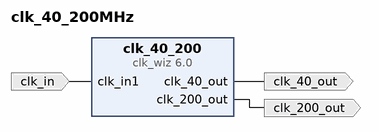
[diagram p0: block diagram of the top level]
# Vivado block design clk_40_200MHz, xc7z010clg400-1, Vivado 2018.2
create_bd_design clk_40_200MHz

create_bd_port -dir I -type clk clk_in
set_property -dict {CONFIG.FREQ_HZ 125000000} [get_bd_ports clk_in]
create_bd_port -dir O -type clk clk_200_out
set_property -dict {CONFIG.FREQ_HZ 200000000} [get_bd_ports clk_200_out]
create_bd_port -dir O -type clk clk_40_out
set_property -dict {CONFIG.FREQ_HZ 40000000} [get_bd_ports clk_40_out]

create_bd_cell -type ip -vlnv xilinx.com:ip:clk_wiz:6.0 clk_40_200
set_property -dict [list \
  CONFIG.CLKOUT2_USED true \
  CONFIG.NUM_OUT_CLKS 2 \
  CONFIG.CLK_OUT1_PORT clk_200_out \
  CONFIG.CLK_OUT2_PORT clk_40_out \
  CONFIG.CLKOUT1_REQUESTED_OUT_FREQ 200.000 \
  CONFIG.CLKOUT2_REQUESTED_OUT_FREQ 40.000 \
  CONFIG.USE_LOCKED false \
  CONFIG.USE_RESET false \
  CONFIG.MMCM_DIVCLK_DIVIDE 1 \
  CONFIG.MMCM_CLKOUT0_DIVIDE_F 5.000 \
  CONFIG.MMCM_CLKOUT1_DIVIDE 25 \
  CONFIG.CLKOUT1_JITTER 109.241 \
  CONFIG.CLKOUT2_JITTER 150.675 \
  CONFIG.CLKOUT2_PHASE_ERROR 96.948 \
] [get_bd_cells clk_40_200]

# ---- connections ----

connect_bd_net -net clk_in1_1_1 [get_bd_ports clk_in] [get_bd_pins clk_40_200/clk_in1]
connect_bd_net [get_bd_pins clk_40_200/clk_200_out] [get_bd_ports clk_200_out]
connect_bd_net [get_bd_pins clk_40_200/clk_40_out] [get_bd_ports clk_40_out]

validate_bd_design
save_bd_design
